# Altium project Testbench__PCB.PrjPcb
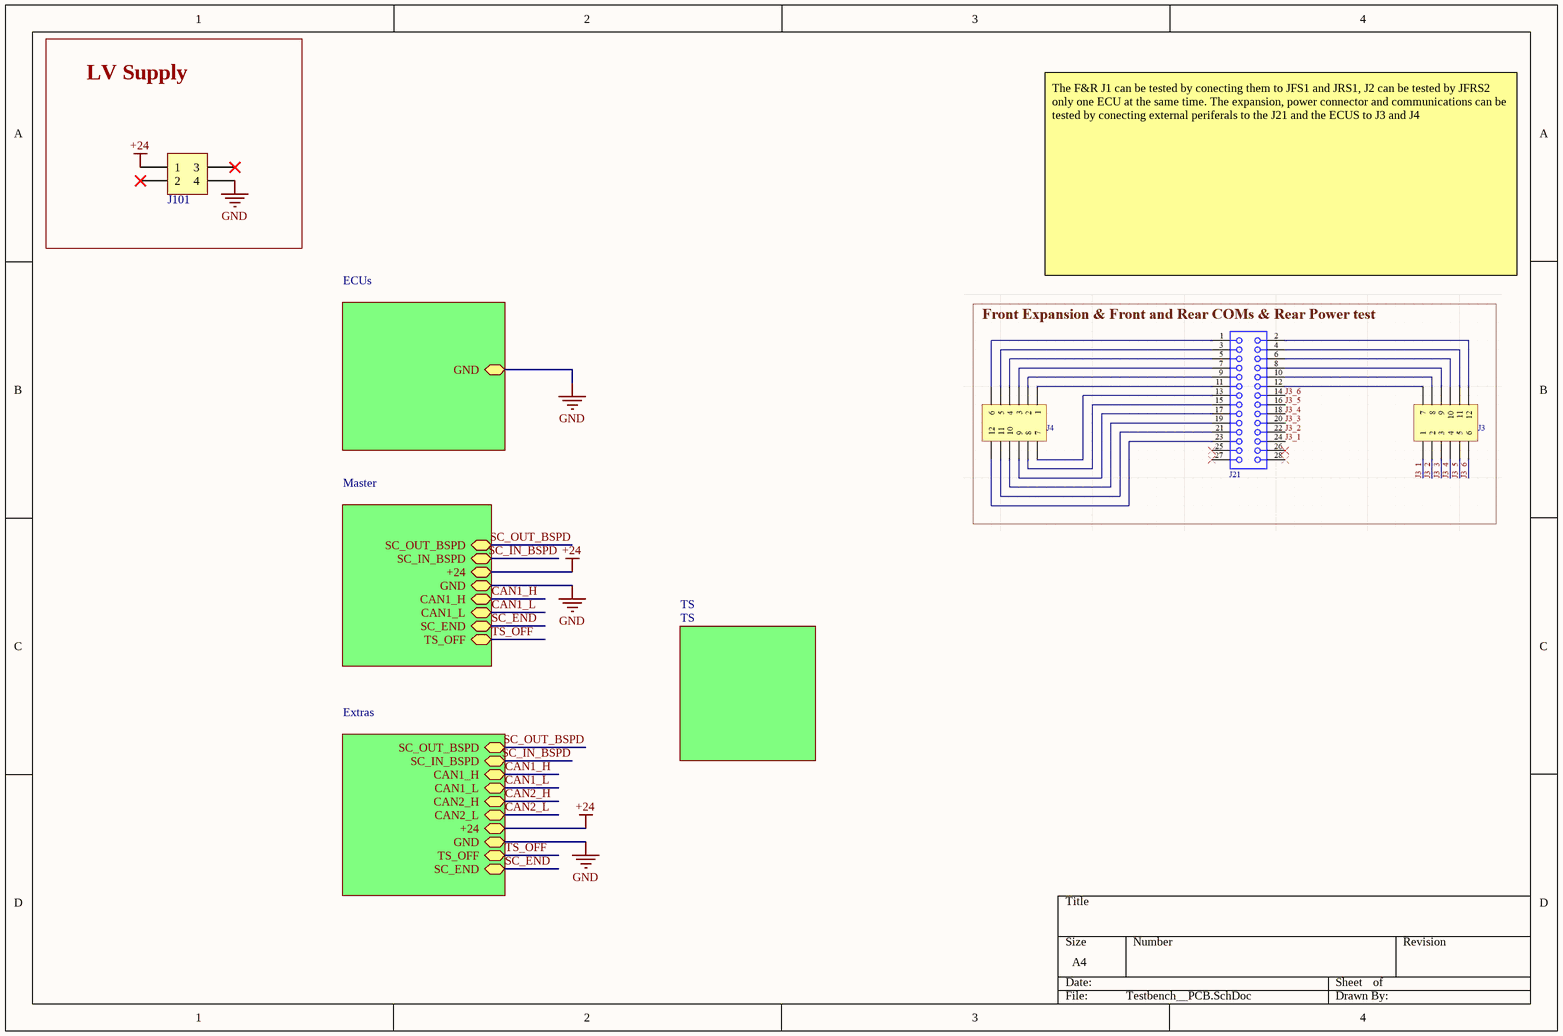
[diagram p0: Testbench__PCB.SchDoc]
5 sheets, 66 parts. Net scope: hierarchical (ports join the sheet entries above them; power ports are global).
Board file: Testbench_PCB.PcbDoc
Sheets:
  Testbench__PCB.SchDoc
    ECUs = ECUs.SchDoc
    Master = Master.SchDoc
    Extras = Extras.SchDoc
    TS = TS.SchDoc

## Sheet Testbench__PCB.SchDoc
size A4; SheetNumber: 1; SheetTotal: 5

### Parts
J101  430450412  [J_MicroFit_2x2_v]  (value not drawn)

### Blocks framed on the sheet
LV Supply: J101

### Sub-sheets
ECUs = ECUs: GND (bidir)
Extras = Extras: CAN1_H (bidir), CAN1_L (bidir), CAN2_H (bidir), CAN2_L (bidir), +24 (bidir), GND (bidir), TS_OFF (bidir), SC_END (bidir), SC_OUT_BSPD (bidir), SC_IN_BSPD (bidir)
Master = Master: SC_OUT_BSPD (bidir), SC_IN_BSPD (bidir), +24 (bidir), GND (bidir), CAN1_H (bidir), CAN1_L (bidir), SC_END (bidir), TS_OFF (bidir)
TS = TS: no entries

### Nets
+24: J101.1 ; sheet Master/+24, sheet Extras/+24
GND: J101.4 ; sheet ECUs/GND, sheet Master/GND, sheet Extras/GND
CAN1_H: sheet Master/CAN1_H, sheet Extras/CAN1_H
CAN1_L: sheet Master/CAN1_L, sheet Extras/CAN1_L
SC_END: sheet Master/SC_END, sheet Extras/SC_END
SC_IN_BSPD: sheet Master/SC_IN_BSPD, sheet Extras/SC_IN_BSPD
SC_OUT_BSPD: sheet Master/SC_OUT_BSPD, sheet Extras/SC_OUT_BSPD
TS_OFF: sheet Master/TS_OFF, sheet Extras/TS_OFF

Not connected (* = marked no-connect by the designer): J101 2* 3*

### Notes on the sheet
- The F&R J1 can be tested by conecting them to JFS1 and JRS1, J2 can be tested by JFRS2 only one ECU at the same time. The expansion, power connector and communications can be tested by conecting external periferals to the J21 and the ECUS to J3 and J4

### Library data of the parts
J101 = J_MicroFit_2x2: Header 2 Row Vertical Polarizing Peg 4 Pin Tin Plate SMT/Glow Wire Kinked Leads; Manufacturer 1: Molex; Manufacturer Part Number 1: 43045-0412; .Creator: DR; Supplier 1: Arrow Electronics; RoHS: Yes; Category: Headers and Wire Housings; Stock 1: 54122; Pricing 1: 1=1,24720, 10=1,02970, 80=0,85390, 2232=0,63810, 6696=0,59030, 11160=0,55550 (USD); ComponentLink1URL: https://datasheet.ciiva.com/19462/883368-19462265.pdf?src-supplier=Jameco; ComponentLink1Description: https://datasheet.ciiva.com/19462/883368-19462265.pdf?src-supplier=Jameco; ComponentLink2URL: https://datasheet.ciiva.com/5158/0430450412-pcb-headers-142874-5158187.pdf?src-supplier=Mouser; ComponentLink2Description: https://datasheet.ciiva.com/5158/0430450412-pcb-headers-142874-5158187.pdf?src-supplier=Mouser; ComponentLink3URL: https://datasheet.ciiva.com/30095/176640430450412-pcb-headers-30095929.pdf?src-supplier=Onlinecomponents.com; ComponentLink3Description: https://datasheet.ciiva.com/30095/176640430450412-pcb-headers-30095929.pdf?src-supplier=Onlinecomponents.com; ComponentLink4URL: https://datasheet.ciiva.com/11747/0900766b800bd7d2-11747137.pdf?src-supplier=RSComponents; ComponentLink4Description: https://datasheet.ciiva.com/11747/0900766b800bd7d2-11747137.pdf?src-supplier=RSComponents; ComponentLink5URL: https://datasheet.ciiva.com/26916/getdatasheetpartid-253008-26916516.pdf?src-supplier=Verical; ComponentLink5Description: https://datasheet.ciiva.com/26916/getdatasheetpartid-253008-26916516.pdf?src-supplier=Verical; ComponentLink6URL: https://datasheet.ciiva.com/22637/1928349-22637530.pdf?src-supplier=Element14; ComponentLink6Description: https://datasheet.ciiva.com/22637/1928349-22637530.pdf?src-supplier=Element14; ComponentLink7URL: https://datasheet.ciiva.com/9468/0430450412-pcb-headers-9468485.pdf?src-supplier=Avnet; ComponentLink7Description: https://datasheet.ciiva.com/9468/0430450412-pcb-headers-9468485.pdf?src-supplier=Avnet; Supplier Part Number 1: 43045-0412

## Sheet ECUs.SchDoc
size A4; SheetNumber: 2; SheetTotal: 5
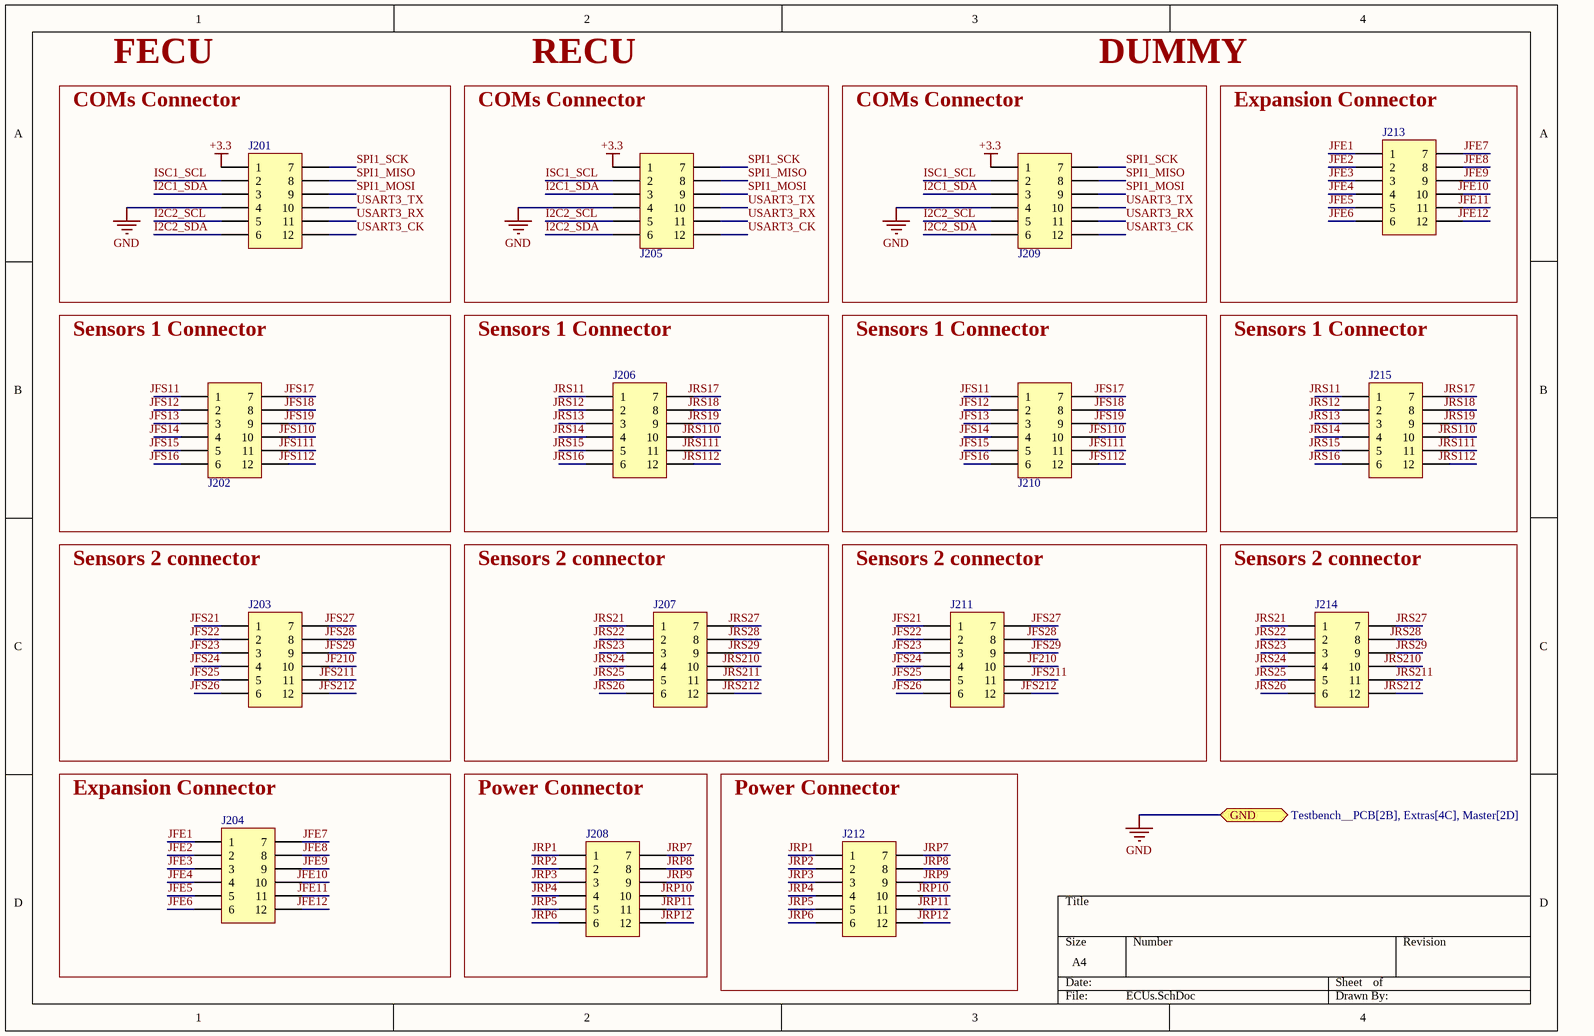
[diagram p1: ECUs.SchDoc]

### Parts
J201  1053101112  [J_NanoFit_2x6_V]  (value not drawn)
J202  1053101112  [J_NanoFit_2x6_V]  (value not drawn)
J203  1053101112  [J_NanoFit_2x6_V]  (value not drawn)
J204  1053101112  [J_NanoFit_2x6_V]  (value not drawn)
J205  1053101112  [J_NanoFit_2x6_V]  (value not drawn)
J206  1053101112  [J_NanoFit_2x6_V]  (value not drawn)
J207  1053101112  [J_NanoFit_2x6_V]  (value not drawn)
J208  1053101112  [J_NanoFit_2x6_V]  (value not drawn)
J209  1053101112  [J_NanoFit_2x6_V]  (value not drawn)
J210  1053101112  [J_NanoFit_2x6_V]  (value not drawn)
J211  1053101112  [J_NanoFit_2x6_V]  (value not drawn)
J212  1053101112  [J_NanoFit_2x6_V]  (value not drawn)
J213  1053101112  [J_NanoFit_2x6_V]  (value not drawn)
J214  1053101112  [J_NanoFit_2x6_V]  (value not drawn)
J215  1053101112  [J_NanoFit_2x6_V]  (value not drawn)

### Blocks framed on the sheet
FECU: J201
RECU: J205
DUMMY: J209
Expansion Connector: J213
Sensors 1 Connector: J202
Sensors 1 Connector: J206
Sensors 1 Connector: J210
Sensors 1 Connector: J215
Sensors 2 connector: J203
Sensors 2 connector: J207
Sensors 2 connector: J211
Sensors 2 connector: J214
Expansion Connector: J204
Power Connector: J208
Power Connector: J212

### Ports
GND (bidir, see Testbench__PCB[2B], Extras[4C], Master[2D])

### Nets
+3.3: J201.1 J205.1 J209.1
GND: J201.4 J205.4 J209.4 ; port GND
I2C1_SDA: J201.3 J205.3 J209.3
I2C2_SCL: J201.5 J205.5 J209.5
I2C2_SDA: J201.6 J205.6 J209.6
ISC1_SCL: J201.2 J205.2 J209.2
JF210: J203.10 J211.10
JFE1: J204.1 J213.1
JFE2: J204.2 J213.2
JFE3: J204.3 J213.3
JFE4: J204.4 J213.4
JFE5: J204.5 J213.5
JFE6: J204.6 J213.6
JFE7: J204.7 J213.7
JFE8: J204.8 J213.8
JFE9: J204.9 J213.9
JFE10: J204.10 J213.10
JFE11: J204.11 J213.11
JFE12: J204.12 J213.12
JFS11: J202.1 J210.1
JFS12: J202.2 J210.2
JFS13: J202.3 J210.3
JFS14: J202.4 J210.4
JFS15: J202.5 J210.5
JFS16: J202.6 J210.6
JFS17: J202.7 J210.7
JFS18: J202.8 J210.8
JFS19: J202.9 J210.9
JFS21: J203.1 J211.1
JFS22: J203.2 J211.2
JFS23: J203.3 J211.3
JFS24: J203.4 J211.4
JFS25: J203.5 J211.5
JFS26: J203.6 J211.6
JFS27: J203.7 J211.7
JFS28: J203.8 J211.8
JFS29: J203.9 J211.9
JFS110: J202.10 J210.10
JFS111: J202.11 J210.11
JFS112: J202.12 J210.12
JFS211: J203.11 J211.11
JFS212: J203.12 J211.12
JRP1: J208.1 J212.1
JRP2: J208.2 J212.2
JRP3: J208.3 J212.3
JRP4: J208.4 J212.4
JRP5: J208.5 J212.5
JRP6: J208.6 J212.6
JRP7: J208.7 J212.7
JRP8: J208.8 J212.8
JRP9: J208.9 J212.9
JRP10: J208.10 J212.10
JRP11: J208.11 J212.11
JRP12: J208.12 J212.12
JRS11: J206.1 J215.1
JRS12: J206.2 J215.2
JRS13: J206.3 J215.3
JRS14: J206.4 J215.4
JRS15: J206.5 J215.5
JRS16: J206.6 J215.6
JRS17: J206.7 J215.7
JRS18: J206.8 J215.8
JRS19: J206.9 J215.9
JRS21: J207.1 J214.1
JRS22: J207.2 J214.2
JRS23: J207.3 J214.3
JRS24: J207.4 J214.4
JRS25: J207.5 J214.5
JRS26: J207.6 J214.6
JRS27: J207.7 J214.7
JRS28: J207.8 J214.8
JRS29: J207.9 J214.9
JRS110: J206.10 J215.10
JRS111: J206.11 J215.11
JRS112: J206.12 J215.12
JRS210: J207.10 J214.10
JRS211: J207.11 J214.11
JRS212: J207.12 J214.12
SPI1_MISO: J201.8 J205.8 J209.8
SPI1_MOSI: J201.9 J205.9 J209.9
SPI1_SCK: J201.7 J205.7 J209.7
USART3_CK: J201.12 J205.12 J209.12
USART3_RX: J201.11 J205.11 J209.11
USART3_TX: J201.10 J205.10 J209.10

### Notes on the sheet
- COMs Connector

### Library data of the parts
J201-J215 = J_NanoFit_2x6_V: Nano-Fit Vertical Header, Through Hole, 2.50mm Pitch, Dual Row, 12 Circuits, with Kinked Pins, Tin (Sn) Plating, Black, Glow-Wire Capable, Tray

## Sheet Master.SchDoc
size A4; SheetNumber: 3; SheetTotal: 5
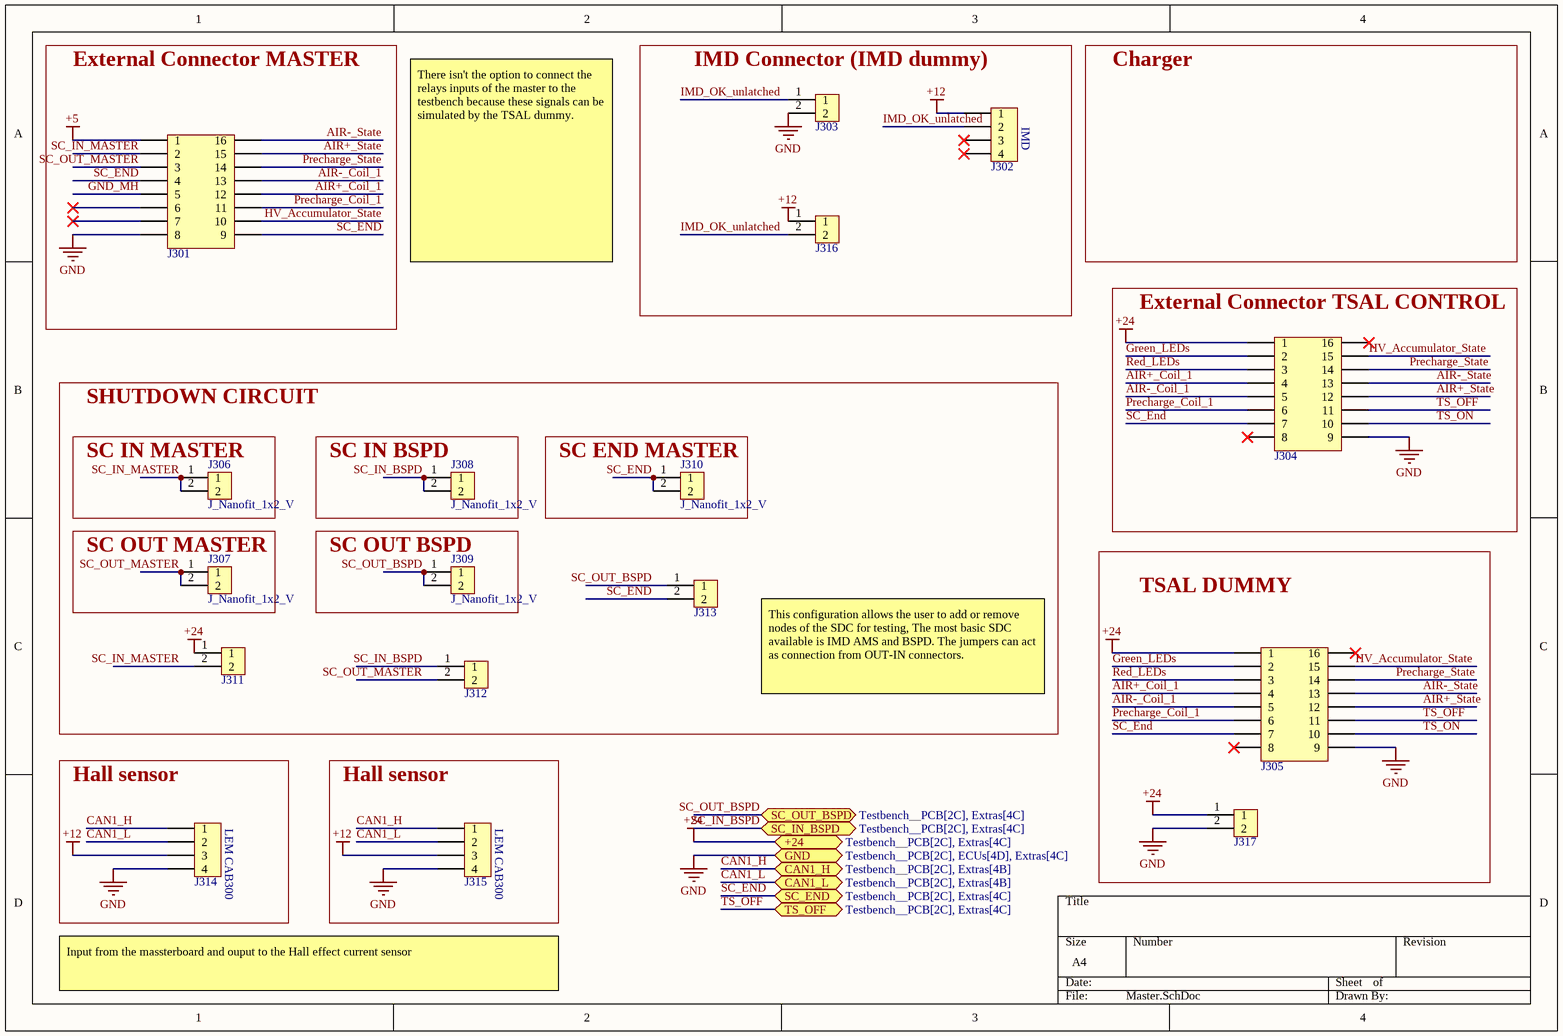
[diagram p2: Master.SchDoc]

### Parts
J301  1053101116  [J_NanoFit_2x8_V]  (value not drawn)
J302  1053091204  [J_NanoFit_1x4_V]  (value not drawn)
J303  61300211121  [J_Pinheader_1x2]  (value not drawn)
J304  1053101116  [J_NanoFit_2x8_V]  (value not drawn)
J305  1053101116  [J_NanoFit_2x8_V]  (value not drawn)
J306  J_Nanofit_1x2_V  [J_NanoFit_1X2_V]
J307  J_Nanofit_1x2_V  [J_NanoFit_1X2_V]
J308  J_Nanofit_1x2_V  [J_NanoFit_1X2_V]
J309  J_Nanofit_1x2_V  [J_NanoFit_1X2_V]
J310  J_Nanofit_1x2_V  [J_NanoFit_1X2_V]
J311  61300211121  [J_Pinheader_1x2]  (value not drawn)
J312  61300211121  [J_Pinheader_1x2]  (value not drawn)
J313  61300211121  [J_Pinheader_1x2]  (value not drawn)
J314  1053091204  [J_NanoFit_1x4_V]  (value not drawn)
J315  1053091204  [J_NanoFit_1x4_V]  (value not drawn)
J316  61300211121  [J_Pinheader_1x2]  (value not drawn)
J317  436500215  [J_MicroFit_2x1]  (value not drawn)

### Blocks framed on the sheet
External Connector MASTER: J301
IMD Connector (IMD dummy): J302 J303 J316
External Connector TSAL CONTROL: J304
SHUTDOWN CIRCUIT: J311-J313
SC IN MASTER: J306
SC IN BSPD: J308
SC END MASTER: J310
SC OUT MASTER: J307
SC OUT BSPD: J309
TSAL DUMMY: J305 J317
Hall sensor: J314
Hall sensor: J315

### Ports
+24 (bidir, see Testbench__PCB[2C], Extras[4C]), CAN1_H (bidir, see Testbench__PCB[2C], Extras[4B]), CAN1_L (bidir, see Testbench__PCB[2C], Extras[4B]), GND (bidir, see Testbench__PCB[2C], ECUs[4D], Extras[4C]), SC_END (bidir, see Testbench__PCB[2C], Extras[4C]), SC_IN_BSPD (bidir, see Testbench__PCB[2C], Extras[4C]), SC_OUT_BSPD (bidir, see Testbench__PCB[2C], Extras[4C]), TS_OFF (bidir, see Testbench__PCB[2C], Extras[4C])

### Nets
+5: J301.1
+12: J302.1 J314.3 J315.3 J316.1
+24: J304.1 J305.1 J311.1 J317.1 ; port +24
GND: J301.8 J303.2 J304.9 J305.9 J314.4 J315.4 J317.2 ; port GND
AIR+_Coil_1: J301.12 J304.4 J305.4
AIR+_State: J301.15 J304.12 J305.12
AIR-_Coil_1: J301.13 J304.5 J305.5
AIR-_State: J301.16 J304.13 J305.13
CAN1_H: J314.1 J315.1 ; port CAN1_H
CAN1_L: J314.2 J315.2 ; port CAN1_L
GND_MH: J301.5
Green_LEDs: J304.2 J305.2
HV_Accumulator_State: J301.10 J304.15 J305.15
IMD_OK_unlatched: J302.2 J303.1 J316.2
Precharge_Coil_1: J301.11 J304.6 J305.6
Precharge_State: J301.14 J304.14 J305.14
Red_LEDs: J304.3 J305.3
SC_END: J301.4 J301.9 J304.7 J305.7 J310.1 J310.2 J313.2 ; port SC_END
SC_IN_BSPD: J308.1 J308.2 J312.1 ; port SC_IN_BSPD
SC_IN_MASTER: J301.2 J306.1 J306.2 J311.2
SC_OUT_BSPD: J309.1 J309.2 J313.1 ; port SC_OUT_BSPD
SC_OUT_MASTER: J301.3 J307.1 J307.2 J312.2
TS_OFF: J304.11 J305.11 ; port TS_OFF
TS_ON: J304.10 J305.10

Not connected (* = marked no-connect by the designer): J301 6* 7*; J302 3* 4*; J304 8* 16*; J305 8* 16*

### Notes on the sheet
- Charger
- (near J302) IMD
- There isn't the option to connect the relays inputs of the master to the testbench because these signals can be simulated by the TSAL dummy.
- This configuration allows the user to add or remove nodes of the SDC for testing, The most basic SDC available is IMD AMS and BSPD. The jumpers can act as connection from OUT-IN connectors.
- (near J314) LEM CAB300
- (near J315) LEM CAB300
- Input from the massterboard and ouput to the Hall effect current sensor

### Library data of the parts
J301 J304 J305 = J_NanoFit_2x8_V: Nano-Fit Vertical Header Through Hole 2.50mm Pitch Dual Row 16 Circuits with Kinked Pins Tin (Sn) Plating Black; Manufacturer 1: Molex; Manufacturer Part Number 1: 105310-1116; Connector Type: Header,Male Pin; Number of Positions: 16; .Creator: AC; Supplier 1: Digi-Key; RoHS: No; Category: Headers and Wire Housings; Stock 1: 84; Pricing 1: 1=3,21000, 10=2,82400, 84=2,24619, 1008=1,86110, 4956=1,66858 (USD); Mount: Through Hole; Contact Plating: Tin; Contact Material: Brass; Contact Shape: Square; Insulation Material: Polymer; Insulation Color: Black; Min Operating Temperature: -40°C; Max Operating Temperature: 105°C; Fastening Type: Latch; Packaging: Tray; Number of Rows: 2; Termination: Kinked Pin; ComponentLink1URL: https://www.molex.com/pdm_docs/sd/1053101210_sd.pdf?src-supplier=Digi-Key; ComponentLink1Description: https://www.molex.com/pdm_docs/sd/1053101210_sd.pdf?src-supplier=Digi-Key; Supplier Part Number 1: WM16885-ND; ComponentLink2Description: Molex; ComponentLink2URL: https://www.molex.com/molex/products/part-detail/pcb_headers/1053101116
J302 J314 J315 = J_NanoFit_1x4_V: Nano-Fit Vertical Header Through Hole 2.50mm Pitch Single Row 4 Circuits with Kinked Pins 0.38; Manufacturer 1: Molex; Manufacturer Part Number 1: 105309-1204; .Creator: DO; Supplier 1: Arrow Electronics; RoHS: No; Category: Headers and Wire Housings; Stock 1: 709; Pricing 1: 1=1,37050, 10=1,11700, 100=0,95270, 500=0,86980, 1000=0,74060, 2500=0,71930, 5000=0,68450, 10000=0,66860 (USD); ComponentLink1URL: http://farnell.com//datasheets/2221349.pdf?src-supplier=Farnell; ComponentLink1Description: http://farnell.com//datasheets/2221349.pdf?src-supplier=Farnell; ComponentLink2URL: http://www.farnell.com/datasheets/2221349.pdf?src-supplier=Newark; ComponentLink2Description: http://www.farnell.com/datasheets/2221349.pdf?src-supplier=Newark; ComponentLink3URL: http://www.literature.molex.com/SQLImages/kelmscott/Molex/PDF_Images/987651-1223.PDF?src-supplier=Digi-Key; ComponentLink3Description: http://www.literature.molex.com/SQLImages/kelmscott/Molex/PDF_Images/987651-1223.PDF?src-supplier=Digi-Key; ComponentLink4URL: http://www.farnell.com/datasheets/2059602.pdf?src-supplier=Element14; ComponentLink4Description: http://www.farnell.com/datasheets/2059602.pdf?src-supplier=Element14; Supplier Part Number 1: 105309-1204
J303 J311-J313 J316 = J_Jumper: CONN HEADER 2 POS 2.54; Manufacturer: Molex; Temperature rating: -40° to +105°C; Category type: PCB-PCB; Product name: Pin Header; Maximum current: 3 A; Maximum voltage: 250 V AC; Connections: 1x2; Current Rating: 3A; Voltage Rating: 250V; Number of Positions: 2; Gender: Male; Connector Type: Male Pin; Pitch: 0.1inch; .Creator: GP; Category: Connector; ComponentLink1Description: Datasheet; ComponentLink1URL: https://www.we-online.com/catalog/datasheet/61300211121.pdf; ComponentLink2Description: Where buy it; ComponentLink2URL: https://www.we-online.com/catalog/en/PHD_2_54_THT_PIN_HEADER_6130XX11121?sq=61300211121&sp=https%3A%2F%2Fwww.we-online.com%2Fweb%2Fen%2Fwuerth_elektronik%2Fsearchpage.php%3Fsearch%3D61300211121#61300211121; Manufacturer part number: 61300211121; Supplier: Würth Elektronik; RoHS: *; Application: Shortcircuit; Flammability: 94V-0; Orientation: Vertical; Mount: Through hole; Supplier 1: RSComponents; Stock 1: 1855; Pricing 1: 5=0,14100, 50=0,09700, 100=0,07800, 200=0,07300, 500=0,06800 (USD); Contact Plating: Gold; Housing Material: PBT; Contact Material: Copper Alloy,Copper; Color: Black; Min Operating Temperature: -40°C; Max Operating Temperature: 125°C; Number of Rows: 1; Contact Gender: Male; Packaging: Bulk; Termination: Through Hole; Number of Contacts: 2; Contact Mating Length: 0.236inch; REACH SVHC: Unknown; Lead Free: Lead Free; ComponentLink3URL: https://datasheet.ciiva.com/13619/6130xx11121-48870-13619345.pdf?src-supplier=Mouser; ComponentLink3Description: https://datasheet.ciiva.com/13619/6130xx11121-48870-13619345.pdf?src-supplier=Mouser; Supplier Part Number 1: 8281581
J306-J310 = J_Nanofit_1x2_V: Nano-Fit Vertical Header, Through Hole, 2.50mm Pitch, Single Row, 2 Circuits, with Kinked Pins, Tin (Sn) Plating,...; Manufacturer: Molex; Manufacturer Part Number: 1053092202; Supplier 1: Mouser; RoHS: No; Stock 1: 6299; Pricing 1: 1=1,09, 10=0,839, 50=0,839, 100=0,686, 1000=0,571, 10000=0,507 (USD); Supplier Part Number 1: 538-105309-2202
J317 = J_MicroFit_2x1: Header 1 Row Vertical Polarizing Peg 2 Pin SMT/Glow Wire Compatible Tin Plate; Manufacturer 1: Molex; Manufacturer Part Number 1: 43650-0215; Supplier 1: Arrow Electronics; RoHS: Yes; Category: Headers and Wire Housings; Stock 1: 11086; Pricing 1: 1=0,87800, 10=0,74400, 80=0,63070, 3264=0,47000, 6528=0,45100, 13056=0,41760 (USD); ComponentLink1URL: https://datasheet.ciiva.com/19462/884109-19462034.pdf?src-supplier=Jameco; ComponentLink1Description: https://datasheet.ciiva.com/19462/884109-19462034.pdf?src-supplier=Jameco; ComponentLink2URL: https://datasheet.ciiva.com/5157/0436500215-pcb-headers-148687-5157608.pdf?src-supplier=Mouser; ComponentLink2Description: https://datasheet.ciiva.com/5157/0436500215-pcb-headers-148687-5157608.pdf?src-supplier=Mouser; ComponentLink3URL: https://datasheet.ciiva.com/16085/0436500215-pcb-headers-16085668.pdf?src-supplier=Onlinecomponents.com; ComponentLink3Description: https://datasheet.ciiva.com/16085/0436500215-pcb-headers-16085668.pdf?src-supplier=Onlinecomponents.com; ComponentLink4URL: https://datasheet.ciiva.com/11748/0900766b80307ce2-11748388.pdf?src-supplier=RSComponents; ComponentLink4Description: https://datasheet.ciiva.com/11748/0900766b80307ce2-11748388.pdf?src-supplier=RSComponents; ComponentLink5URL: https://datasheet.ciiva.com/9432/0436500215-pcb-headers-9432850.pdf?src-supplier=Avnet; ComponentLink5Description: https://datasheet.ciiva.com/9432/0436500215-pcb-headers-9432850.pdf?src-supplier=Avnet; ComponentLink6URL: https://datasheet.ciiva.com/7920/1889390-7920892.pdf?src-supplier=Element14; ComponentLink6Description: https://datasheet.ciiva.com/7920/1889390-7920892.pdf?src-supplier=Element14; Supplier Part Number 1: 43650-0215

## Sheet Extras.SchDoc
size A4; SheetNumber: 4; SheetTotal: 5
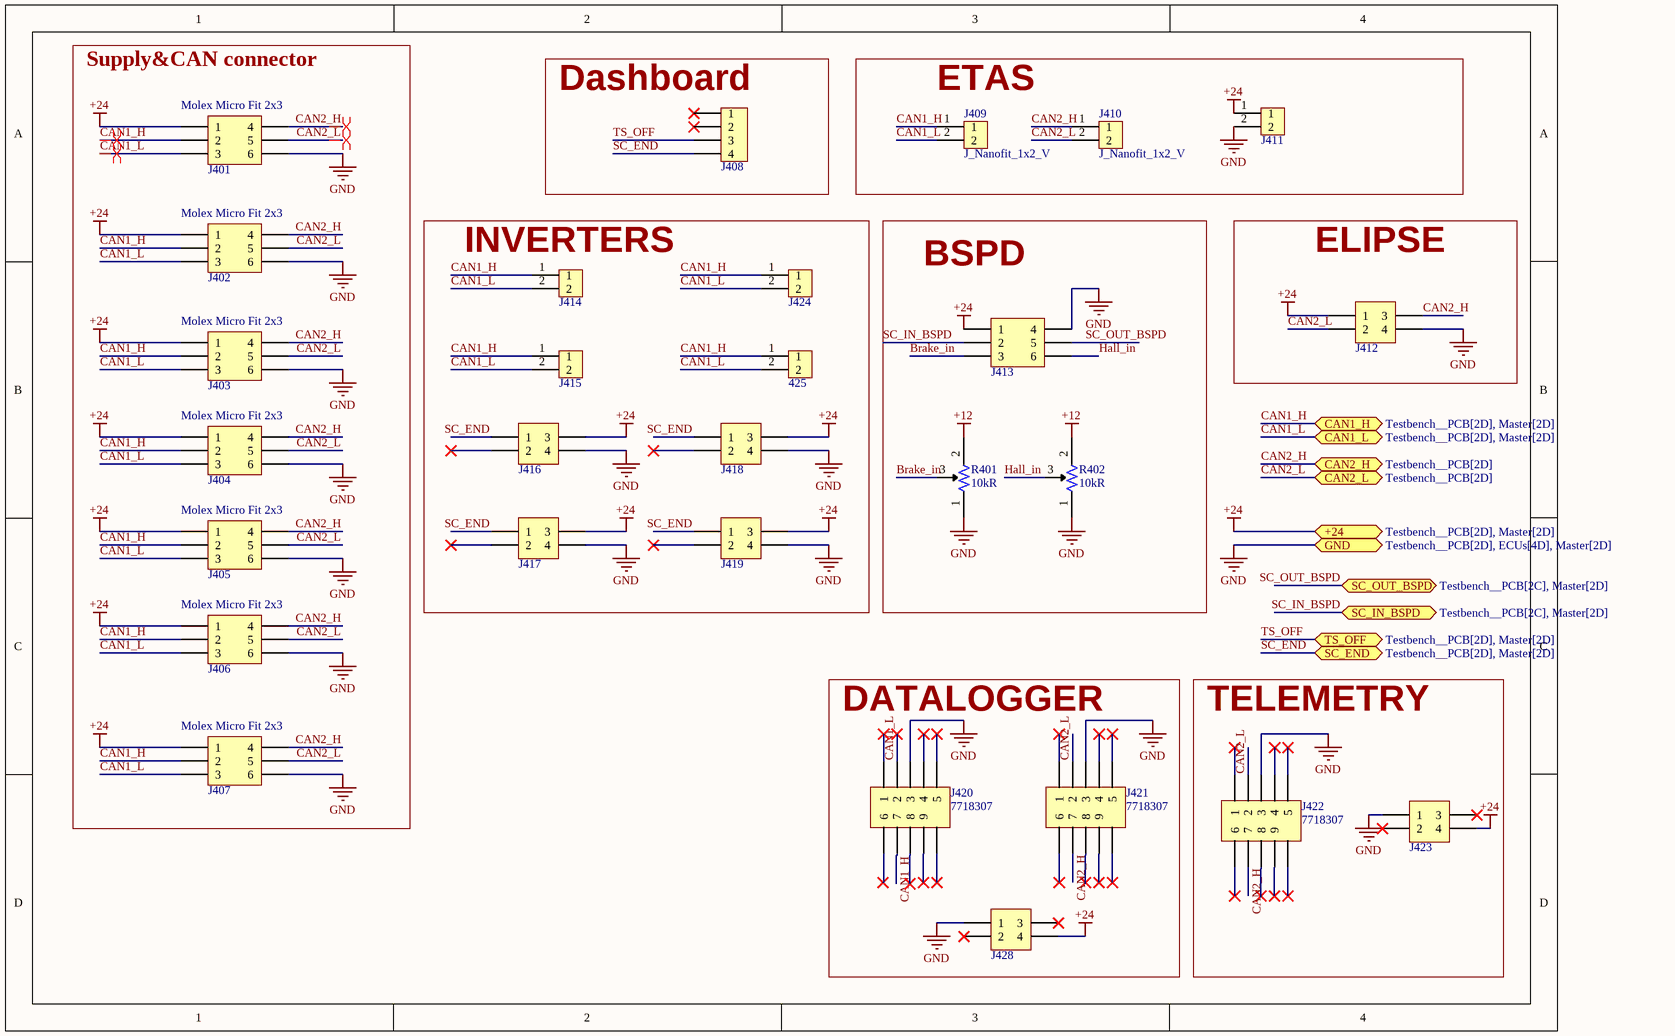
[diagram p3: Extras.SchDoc]

### Parts
425  436500215  [J_MicroFit_2x1]  (value not drawn)
J401  Molex Micro Fit 2x3  [J_MicroFit_2x3_V]
J402  Molex Micro Fit 2x3  [J_MicroFit_2x3_V]
J403  Molex Micro Fit 2x3  [J_MicroFit_2x3_V]
J404  Molex Micro Fit 2x3  [J_MicroFit_2x3_V]
J405  Molex Micro Fit 2x3  [J_MicroFit_2x3_V]
J406  Molex Micro Fit 2x3  [J_MicroFit_2x3_V]
J407  Molex Micro Fit 2x3  [J_MicroFit_2x3_V]
J408  1053091204  [J_NanoFit_1x4_V]  (value not drawn)
J409  J_Nanofit_1x2_V  [J_NanoFit_1X2_V]
J410  J_Nanofit_1x2_V  [J_NanoFit_1X2_V]
J411  436500215  [J_MicroFit_2x1]  (value not drawn)
J412  J_NanoFit_2x2  [J_NanoFit_2x2_v]  (value not drawn)
J413  43045-0612  [J_MicroFit_2x3_V]  (value not drawn)
J414  436500215  [J_MicroFit_2x1]  (value not drawn)
J415  436500215  [J_MicroFit_2x1]  (value not drawn)
J416  J_NanoFit_2x2  [J_NanoFit_2x2_v]  (value not drawn)
J417  J_NanoFit_2x2  [J_NanoFit_2x2_v]  (value not drawn)
J418  J_NanoFit_2x2  [J_NanoFit_2x2_v]  (value not drawn)
J419  J_NanoFit_2x2  [J_NanoFit_2x2_v]  (value not drawn)
J420  Supplier Part Number 1: 7718307  [J_VGA_CONNECTOR]  (hidden comment: 618009231221)
J421  Supplier Part Number 1: 7718307  [J_VGA_CONNECTOR]  (hidden comment: 618009231221)
J422  Supplier Part Number 1: 7718307  [J_VGA_CONNECTOR]  (hidden comment: 618009231221)
J423  J_NanoFit_2x2  [J_NanoFit_2x2_v]  (value not drawn)
J424  436500215  [J_MicroFit_2x1]  (value not drawn)
J428  J_NanoFit_2x2  [J_NanoFit_2x2_v]  (value not drawn)
R401  Resistance: 10kR  [R10k-VTR]  (hidden comment: 3296W-1-103LF)
R402  Resistance: 10kR  [R10k-VTR]  (hidden comment: 3296W-1-103LF)

### Blocks framed on the sheet
Supply&CAN connector: J401-J407
Dashboard: J408
ETAS: J409-J411
INVERTERS: 425 J414-J419 J424
BSPD: J413 R401 R402
ELIPSE: J412
DATALOGGER: J420 J421 J428
TELEMETRY: J422 J423

### Ports
+24 (bidir, see Testbench__PCB[2D], Master[2D]), CAN1_H (bidir, see Testbench__PCB[2D], Master[2D]), CAN1_L (bidir, see Testbench__PCB[2D], Master[2D]), CAN2_H (bidir, see Testbench__PCB[2D]), CAN2_L (bidir, see Testbench__PCB[2D]), GND (bidir, see Testbench__PCB[2D], ECUs[4D], Master[2D]), SC_END (bidir, see Testbench__PCB[2D], Master[2D]), SC_IN_BSPD (bidir, see Testbench__PCB[2C], Master[2D]), SC_OUT_BSPD (bidir, see Testbench__PCB[2C], Master[2D]), TS_OFF (bidir, see Testbench__PCB[2D], Master[2D])

### Nets
+12: R401.2 R402.2
+24: J401.1 J402.1 J403.1 J404.1 J405.1 J406.1 J407.1 J411.1 J412.1 J413.1 J416.3 J417.3 J418.3 J419.3 J423.4 J428.4 ; port +24
GND: J401.6 J402.6 J403.6 J404.6 J405.6 J406.6 J407.6 J411.2 J412.4 J413.4 J416.4 J417.4 J418.4 J419.4 J420.3 J421.3 J422.3 J423.1 J428.1 R401.1 R402.1 ; port GND
Brake_in: J413.3 R401.3
CAN1_H: 425.1 J401.2 J402.2 J403.2 J404.2 J405.2 J406.2 J407.2 J409.1 J414.1 J415.1 J420.7 J424.1 ; port CAN1_H
CAN1_L: 425.2 J401.3 J402.3 J403.3 J404.3 J405.3 J406.3 J407.3 J409.2 J414.2 J415.2 J420.2 J424.2 ; port CAN1_L
CAN2_H: J401.4 J402.4 J403.4 J404.4 J405.4 J406.4 J407.4 J410.1 J412.3 J421.7 J422.7 ; port CAN2_H
CAN2_L: J401.5 J402.5 J403.5 J404.5 J405.5 J406.5 J407.5 J410.2 J412.2 J421.2 J422.2 ; port CAN2_L
Hall_in: J413.6 R402.3
SC_END: J408.4 J416.1 J417.1 J418.1 J419.1 ; port SC_END
SC_IN_BSPD: J413.2 ; port SC_IN_BSPD
SC_OUT_BSPD: J413.5 ; port SC_OUT_BSPD
TS_OFF: J408.3 ; port TS_OFF

Not connected (* = marked no-connect by the designer): J408 1* 2*; J416 2*; J417 2*; J418 2*; J419 2*; J420 1* 4* 5* 6* 8* 9* SHIELD*; J421 1* 4* 5* 6* 8* 9* SHIELD*; J422 1* 4* 5* 6* 8* 9* SHIELD*; J423 2* 3*; J428 2* 3*

### Layout directives
differential pair: CAN1_H, CAN1_L, CAN2_H, CAN2_L

### Library data of the parts
425 J411 J414 J415 J424 = J_MicroFit_2x1: as J317 on sheet Master; Supplier 1: Arrow Electronics; RoHS: Yes; Category: Headers and Wire Housings; Stock 1: 11086; Pricing 1: 1=0,87800, 10=0,74400, 80=0,63070, 3264=0,47000, 6528=0,45100, 13056=0,41760 (USD); ComponentLink1URL: https://datasheet.ciiva.com/19462/884109-19462034.pdf?src-supplier=Jameco; ComponentLink1Description: https://datasheet.ciiva.com/19462/884109-19462034.pdf?src-supplier=Jameco; ComponentLink2URL: https://datasheet.ciiva.com/5157/0436500215-pcb-headers-148687-5157608.pdf?src-supplier=Mouser; ComponentLink2Description: https://datasheet.ciiva.com/5157/0436500215-pcb-headers-148687-5157608.pdf?src-supplier=Mouser; ComponentLink3URL: https://datasheet.ciiva.com/16085/0436500215-pcb-headers-16085668.pdf?src-supplier=Onlinecomponents.com; ComponentLink3Description: https://datasheet.ciiva.com/16085/0436500215-pcb-headers-16085668.pdf?src-supplier=Onlinecomponents.com; ComponentLink4URL: https://datasheet.ciiva.com/11748/0900766b80307ce2-11748388.pdf?src-supplier=RSComponents; ComponentLink4Description: https://datasheet.ciiva.com/11748/0900766b80307ce2-11748388.pdf?src-supplier=RSComponents; ComponentLink5URL: https://datasheet.ciiva.com/9432/0436500215-pcb-headers-9432850.pdf?src-supplier=Avnet; ComponentLink5Description: https://datasheet.ciiva.com/9432/0436500215-pcb-headers-9432850.pdf?src-supplier=Avnet; ComponentLink6URL: https://datasheet.ciiva.com/7920/1889390-7920892.pdf?src-supplier=Element14; ComponentLink6Description: https://datasheet.ciiva.com/7920/1889390-7920892.pdf?src-supplier=Element14; Supplier Part Number 1: 43650-0215
J401-J407 = J_MicroFit_2x3_V: Micro fit Header, 2 Row, Vertical, Polarizing Peg, 6 Pin, Tin Plate, SMT/Glow Wire, Kinked Leads; Manufacturer Part Number: 43045-0612; .Creator: DO; ComponentLink8Description: Where buy it; ComponentLink8URL: https://www.molex.com/molex/products/part-detail/pcb_headers/0430450612; Supplier 1: RSComponents; Manufacturer: Molex; RoHS: Yes; Category: Headers and Wire Housings; Stock 1: 2635; Pricing 1: 5=1,45500, 100=1,26700, 375=1,08900, 1500=0,90900, 3000=0,72900 (USD); ComponentLink1URL: https://www.molex.com/pdm_docs/sd/430450612_sd.pdf; ComponentLink1Description: Datasheet; ComponentLink2URL: https://datasheet.ciiva.com/11748/0900766b800bd7d2-11748707.pdf?src-supplier=RSComponents; ComponentLink2Description: https://datasheet.ciiva.com/11748/0900766b800bd7d2-11748707.pdf?src-supplier=RSComponents; ComponentLink3URL: https://datasheet.ciiva.com/19462/883464-19462371.pdf?src-supplier=Jameco; ComponentLink3Description: https://datasheet.ciiva.com/19462/883464-19462371.pdf?src-supplier=Jameco; ComponentLink4URL: https://datasheet.ciiva.com/30194/128550430450612-pcb-headers-30194512.pdf?src-supplier=Onlinecomponents.com; ComponentLink4Description: https://datasheet.ciiva.com/30194/128550430450612-pcb-headers-30194512.pdf?src-supplier=Onlinecomponents.com; ComponentLink5URL: https://datasheet.ciiva.com/9468/0430450612-pcb-headers-9468492.pdf?src-supplier=Avnet; ComponentLink5Description: https://datasheet.ciiva.com/9468/0430450612-pcb-headers-9468492.pdf?src-supplier=Avnet; Supplier Part Number 1: 2332898
J408 = J_NanoFit_1x4_V: as J302 on sheet Master; Supplier 1: Arrow Electronics; RoHS: No; Category: Headers and Wire Housings; Stock 1: 709; Pricing 1: 1=1,37050, 10=1,11700, 100=0,95270, 500=0,86980, 1000=0,74060, 2500=0,71930, 5000=0,68450, 10000=0,66860 (USD); ComponentLink1URL: http://farnell.com//datasheets/2221349.pdf?src-supplier=Farnell; ComponentLink1Description: http://farnell.com//datasheets/2221349.pdf?src-supplier=Farnell; ComponentLink2URL: http://www.farnell.com/datasheets/2221349.pdf?src-supplier=Newark; ComponentLink2Description: http://www.farnell.com/datasheets/2221349.pdf?src-supplier=Newark; ComponentLink3URL: http://www.literature.molex.com/SQLImages/kelmscott/Molex/PDF_Images/987651-1223.PDF?src-supplier=Digi-Key; ComponentLink3Description: http://www.literature.molex.com/SQLImages/kelmscott/Molex/PDF_Images/987651-1223.PDF?src-supplier=Digi-Key; ComponentLink4URL: http://www.farnell.com/datasheets/2059602.pdf?src-supplier=Element14; ComponentLink4Description: http://www.farnell.com/datasheets/2059602.pdf?src-supplier=Element14; Supplier Part Number 1: 105309-1204
J409 J410 = J_Nanofit_1x2_V: as J306 on sheet Master; Supplier 1: Mouser; RoHS: No; Stock 1: 6299; Pricing 1: 1=1,09, 10=0,839, 50=0,839, 100=0,686, 1000=0,571, 10000=0,507 (USD); Supplier Part Number 1: 538-105309-2202
J412 J416-J419 J423 J428 = J_NanoFit_2x2: Conn Nano-Fit Power HDR 4 POS 2.5mm Solder ST Through Hole 4 Terminal Single Port Tray; Manufacturer 1: Molex; Manufacturer Part Number 1: 1053101104; Supplier 1: Farnell; RoHS: Yes; Category: Uncategorized; Stock 1: 255; Pricing 1: 1=1,43000, 10=1,18000, 50=0,74900, 100=0,72900, 500=0,71400, 1000=0,70700 (EUR); ComponentLink1URL: https://www.molex.com/pdm_docs/ps/PS-105300-100-001.pdf?src-supplier=Digi-Key; ComponentLink1Description: https://www.molex.com/pdm_docs/ps/PS-105300-100-001.pdf?src-supplier=Digi-Key; Supplier Part Number 1: 2820681
J413 = J_MicroFit_2x3_V: Micro fit Header, 2 Row, Vertical, Polarizing Peg, 6 Pin, Tin Plate, SMT/Glow Wire, Kinked Leads; Manufacturer: Molex; .Creator: DO; ComponentLink8Description: Where buy it; ComponentLink8URL: https://www.molex.com/molex/products/part-detail/pcb_headers/0430450612; Supplier 1: RSComponents; Manufacturer Part Number: 43045-0612; RoHS: Yes; Category: Headers and Wire Housings; Stock 1: 2635; Pricing 1: 5=1,45500, 100=1,26700, 375=1,08900, 1500=0,90900, 3000=0,72900 (USD); ComponentLink1URL: https://www.molex.com/pdm_docs/sd/430450612_sd.pdf; ComponentLink1Description: Datasheet; ComponentLink2URL: https://datasheet.ciiva.com/11748/0900766b800bd7d2-11748707.pdf?src-supplier=RSComponents; ComponentLink2Description: https://datasheet.ciiva.com/11748/0900766b800bd7d2-11748707.pdf?src-supplier=RSComponents; ComponentLink3URL: https://datasheet.ciiva.com/19462/883464-19462371.pdf?src-supplier=Jameco; ComponentLink3Description: https://datasheet.ciiva.com/19462/883464-19462371.pdf?src-supplier=Jameco; ComponentLink4URL: https://datasheet.ciiva.com/30194/128550430450612-pcb-headers-30194512.pdf?src-supplier=Onlinecomponents.com; ComponentLink4Description: https://datasheet.ciiva.com/30194/128550430450612-pcb-headers-30194512.pdf?src-supplier=Onlinecomponents.com; ComponentLink5URL: https://datasheet.ciiva.com/9468/0430450612-pcb-headers-9468492.pdf?src-supplier=Avnet; ComponentLink5Description: https://datasheet.ciiva.com/9468/0430450612-pcb-headers-9468492.pdf?src-supplier=Avnet; Supplier Part Number 1: 2332898
J420-J422 = J_VGA_CONNECTOR: 9 Way Right Angle Through Hole PCB D-sub Connector Plug; 2.77mm; 2.84mm Pitch; Manufacturer: Wurth Electronics; Gender: Male; Current Rating: 3A; Voltage Rating: 125V; Number of Contacts: 9; Supplier 1: Rs; Manufacturer Part Number: 618009231221; RoHS: Yes; Category: D-Sub Connectors; Stock 1: 136; Pricing 1: 1=2,78, 10=2,59, 50=2,45, 100=2,3 (EUR); Mounting Technology: Through Hole; Contact Material: Copper Alloy; Contact Plating: Gold; Housing Material: Steel; Min Operating Temperature: -40°C; Max Operating Temperature: 85°C; Number of Rows: 2; Termination: SMD/SMT; Orientation: Right Angle; Series: 618; Length: 30.8mm; Width: 12.5mm; Depth: 18.5mm; Pitch: 2.84mm; RoHS Compliant: Yes; Reach SVHC Compliant: Unknown; ComponentLink1URL: https://datasheet.ciiva.com/12669/6180xx231221-12669204.pdf?src-supplier=Mouser; ComponentLink1Description: https://datasheet.ciiva.com/12669/6180xx231221-12669204.pdf?src-supplier=Mouser; ComponentLink2URL: https://datasheet.ciiva.com/25605/0900766b81191766-25605476.pdf?src-supplier=Rs; ComponentLink2Description: https://datasheet.ciiva.com/25605/0900766b81191766-25605476.pdf?src-supplier=Rs; ComponentLink3URL: https://datasheet.ciiva.com/1426/1442191-1426429.pdf?src-supplier=Element14; ComponentLink3Description: https://datasheet.ciiva.com/1426/1442191-1426429.pdf?src-supplier=Element14
R401 R402 = R10k-VTR: Trimmer, Cermet, Rest 10 Kilohms, PCB, 25 Turns, Pwr-Rtg 0.5W, 3296 Series; Manufacturer: Bourns; Tolerance: 10%; Power Rating: 500mW; Number of Turns: 25; Temperature Coefficient: 100ppm/°C; Insulation Resistance: 1GR; .Creator: DO; Supplier 1: RSComponents; Manufacturer Part Number: 3296W-1-103LF; RoHS: Yes; Category: Variable Resistors and Potentiometers; Stock 1: 3300; Pricing 1: 50=2,54800, 100=2,31900, 200=2,14000, 300=1,88400, 500=1,55300 (USD); Mount: PCB,Through Hole; Weight: 0.03oz; Color: Blue; Contact Plating: Tin,Matte; Min Operating Temperature: -55°C; Max Operating Temperature: 125°C; Packaging: Rail/Tube; Package Quantity: 50; Termination: Pin; Resistor Type: Cermet; Technology: CERMET; Taper: Linear; Max Power Dissipation: 500mW; Series: 3296; Resistance Tolerance: 10%; Length: 9.53mm; Width: 9.53mm; Height: 0.395inch; Depth: 4.83mm; Radiation Hardening: No; REACH SVHC: No SVHC; Military Standard: Not; Lead Free: Lead Free; RoHS Compliant: Yes; ComponentLink1URL: https://datasheet.ciiva.com/19454/853572-19454866.pdf?src-supplier=Jameco; ComponentLink1Description: https://datasheet.ciiva.com/19454/853572-19454866.pdf?src-supplier=Jameco; ComponentLink2URL: https://datasheet.ciiva.com/11830/0900766b8069ccf4-11830871.pdf?src-supplier=RSComponents; ComponentLink2Description: https://datasheet.ciiva.com/11830/0900766b8069ccf4-11830871.pdf?src-supplier=RSComponents; ComponentLink3URL: https://datasheet.ciiva.com/29122/447277-da-01-en-trimmer-tht3296w-1-103lf-10k-0-5w-29122362.pdf?src-supplier=Conrad; ComponentLink3Description: https://datasheet.ciiva.com/29122/447277-da-01-en-trimmer-tht3296w-1-103lf-10k-0-5w-29122362.pdf?src-supplier=Conrad; ComponentLink4URL: https://datasheet.ciiva.com/26913/3296w-1-103lf-26913885.pdf?src-supplier=IIIC; ComponentLink4Description: https://datasheet.ciiva.com/26913/3296w-1-103lf-26913885.pdf?src-supplier=IIIC; ComponentLink5URL: https://datasheet.ciiva.com/1131/1815117-1131273.pdf?src-supplier=Element14; ComponentLink5Description: https://datasheet.ciiva.com/1131/1815117-1131273.pdf?src-supplier=Element14; ComponentLink6URL: https://datasheet.ciiva.com/18411/70153578-18411561.pdf?src-supplier=Allied+Electronics; ComponentLink6Description: https://datasheet.ciiva.com/18411/70153578-18411561.pdf?src-supplier=Allied+Electronics; ComponentLink7URL: https://datasheet.ciiva.com/3266/3296-3266187.pdf?src-supplier=Avnet; ComponentLink7Description: https://datasheet.ciiva.com/3266/3296-3266187.pdf?src-supplier=Avnet; ComponentLink8URL: https://datasheet.ciiva.com/30093/3296-30093899.pdf?src-supplier=Onlinecomponents.com; ComponentLink8Description: https://datasheet.ciiva.com/30093/3296-30093899.pdf?src-supplier=Onlinecomponents.com; ComponentLink9URL: https://datasheet.ciiva.com/2156/3296-2156893.pdf?src-supplier=Digi-Key; ComponentLink9Description: https://datasheet.ciiva.com/2156/3296-2156893.pdf?src-supplier=Digi-Key; ComponentLink10URL: https://datasheet.ciiva.com/14173/ew3296-dat-e-14173022.pdf?src-supplier=Distrelec; ComponentLink10Description: https://datasheet.ciiva.com/14173/ew3296-dat-e-14173022.pdf?src-supplier=Distrelec; Supplier Part Number 1: 1673377; ComponentLink11Description: Where buy it; ComponentLink11URL: https://es.rs-online.com/web/p/potenciometros-de-ajuste/5219647

## Sheet TS.SchDoc
size A4; SheetNumber: 5; SheetTotal: 5
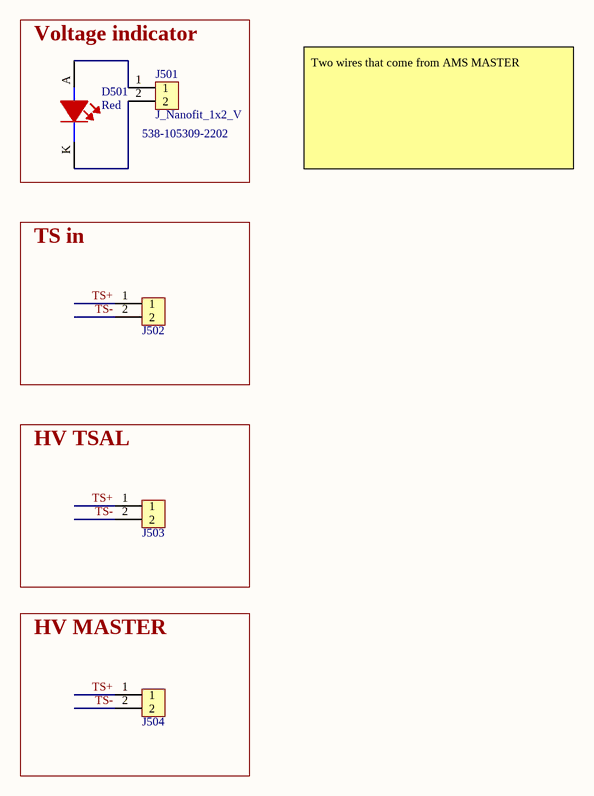
[diagram p4: TS.SchDoc]

### Parts
D501  Color: Red  [LED-THT/WE/D3.9H10.5]  (hidden comment: 150080RS75000)
J501  J_Nanofit_1x2_V  Supplier Part Number 1: 538-105309-2202  [J_NanoFit_1X2_V]
J502  436500215  [J_MicroFit_2x1]  (value not drawn)
J503  436500215  [J_MicroFit_2x1]  (value not drawn)
J504  436500215  [J_MicroFit_2x1]  (value not drawn)

### Blocks framed on the sheet
Voltage indicator: D501 J501
TS in: J502
HV TSAL: J503
HV MASTER: J504

### Nets
TS+: J502.1 J503.1 J504.1
TS-: J502.2 J503.2 J504.2
NetD501_A: D501.A J501.1
NetD501_K: D501.K J501.2

### Notes on the sheet
- Two wires that come from AMS MASTER

### Library data of the parts
D501 = LEDRS-THT: 0805(H=0.8mm) 红色 高亮 λD=625nm VF=2V IF=30mA PD=72mW; Manufacturer 1: Wurth Electronics; Luminous Intensity: 150mcd; Viewing Angle: 140°; Forward Voltage: 2V; Wavelength: 625nm; Lens Style: Clear,Rectangular; Forward Current: 30mA; Test Current: 20mA; .Creator: DR; ComponentLink1Description: Datasheet; ComponentLink1URL: https://www.we-online.com/catalog/datasheet/150080RS75000.pdf; ComponentLink2Description: Where buy it; ComponentLink2URL: https://katalog.we-online.de/en/led/WL-SMCW/150080RS75000; Supplier 1: RSComponents; Manufacturer Part Number 1: 150080RS75000; RoHS: Yes; Category: LEDs; Stock 1: 1; Pricing 1: 50=0,19300, 500=0,12900, 1000=0,12300, 2000=0,11700, 4000=0,11100 (USD); Mount: Surface Mount; Case/Package: 0805; Case Code (Metric): 2012; Case Code (Imperial): 0805; Min Operating Temperature: -40°C; Max Operating Temperature: 85°C; Package Quantity: 4000; Packaging: Tape and Reel; Dominant Wavelength: 625nm; Length: 2mm; Width: 1.25mm; Height: 0.7mm; REACH SVHC: Unknown; RoHS Compliant: Yes; ComponentLink3URL: https://datasheet.ciiva.com/22656/150080rs75000-22656961.pdf?src-supplier=Element14; ComponentLink3Description: https://datasheet.ciiva.com/22656/150080rs75000-22656961.pdf?src-supplier=Element14; ComponentLink4URL: https://datasheet.ciiva.com/29279/759435-da-01-en-chipled-0805-w-kl-rot-150080rs75000-29279032.pdf?src-supplier=Conrad; ComponentLink4Description: https://datasheet.ciiva.com/29279/759435-da-01-en-chipled-0805-w-kl-rot-150080rs75000-29279032.pdf?src-supplier=Conrad; Supplier Part Number 1: 8154225P
J501 = J_Nanofit_1x2_V: as J306 on sheet Master; Supplier 1: Mouser; RoHS: No; Stock 1: 6299; Pricing 1: 1=1,09, 10=0,839, 50=0,839, 100=0,686, 1000=0,571, 10000=0,507 (USD)
J502-J504 = J_MicroFit_2x1: as J317 on sheet Master; Supplier 1: Arrow Electronics; RoHS: Yes; Category: Headers and Wire Housings; Stock 1: 11086; Pricing 1: 1=0,87800, 10=0,74400, 80=0,63070, 3264=0,47000, 6528=0,45100, 13056=0,41760 (USD); ComponentLink1URL: https://datasheet.ciiva.com/19462/884109-19462034.pdf?src-supplier=Jameco; ComponentLink1Description: https://datasheet.ciiva.com/19462/884109-19462034.pdf?src-supplier=Jameco; ComponentLink2URL: https://datasheet.ciiva.com/5157/0436500215-pcb-headers-148687-5157608.pdf?src-supplier=Mouser; ComponentLink2Description: https://datasheet.ciiva.com/5157/0436500215-pcb-headers-148687-5157608.pdf?src-supplier=Mouser; ComponentLink3URL: https://datasheet.ciiva.com/16085/0436500215-pcb-headers-16085668.pdf?src-supplier=Onlinecomponents.com; ComponentLink3Description: https://datasheet.ciiva.com/16085/0436500215-pcb-headers-16085668.pdf?src-supplier=Onlinecomponents.com; ComponentLink4URL: https://datasheet.ciiva.com/11748/0900766b80307ce2-11748388.pdf?src-supplier=RSComponents; ComponentLink4Description: https://datasheet.ciiva.com/11748/0900766b80307ce2-11748388.pdf?src-supplier=RSComponents; ComponentLink5URL: https://datasheet.ciiva.com/9432/0436500215-pcb-headers-9432850.pdf?src-supplier=Avnet; ComponentLink5Description: https://datasheet.ciiva.com/9432/0436500215-pcb-headers-9432850.pdf?src-supplier=Avnet; ComponentLink6URL: https://datasheet.ciiva.com/7920/1889390-7920892.pdf?src-supplier=Element14; ComponentLink6Description: https://datasheet.ciiva.com/7920/1889390-7920892.pdf?src-supplier=Element14; Supplier Part Number 1: 43650-0215

## Nets that join several sheets
+12: Master (J302.1 J314.3 J315.3 J316.1), Extras (R401.2 R402.2)
+24: Testbench__PCB (J101.1), Master (J304.1 J305.1 J311.1 J317.1), Extras (16 pins)
GND: Testbench__PCB (J101.4), ECUs (J201.4 J205.4 J209.4), Master (7 pins), Extras (21 pins)
CAN1_H: Master (J314.1 J315.1), Extras (13 pins)
CAN1_L: Master (J314.2 J315.2), Extras (13 pins)
SC_END: Master (7 pins), Extras (5 pins)
SC_IN_BSPD: Master (J308.1 J308.2 J312.1), Extras (J413.2)
SC_OUT_BSPD: Master (J309.1 J309.2 J313.1), Extras (J413.5)
TS_OFF: Master (J304.11 J305.11), Extras (J408.3)